# EAGLE design usb2ax_v3.2 (EAGLE 7.5.0)
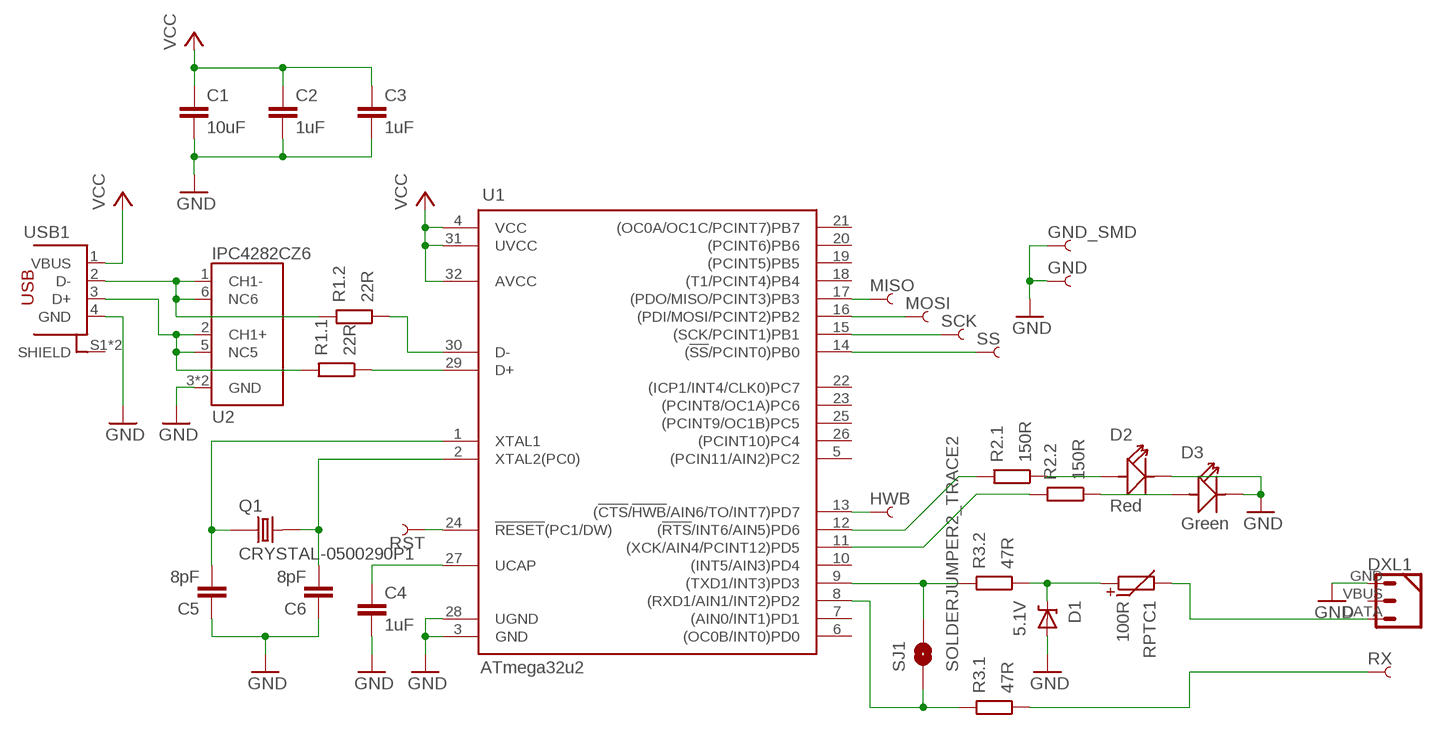
[diagram p0: schematic, sheet 1]

## Parts
C1  10uF  C0805_L  [0805_L]
C2  1uF  C0402  [0402_N]
C3  1uF  C0402  [0402_N]
C4  1uF  C0402  [0402_N]
C5  8pF  C0402  [0402_N]
C6  8pF  C0402  [0402_N]
D1  5.1V  DIODE_ZENER-923  [SOD-923_N]
D2  Red  LED  [LED0603]
D3  Green  LED  [LED0603]
DXL1  DYNAMIXEL_3POS  [DYMANIXEL_3POS_RIGHT]
GND  PIN_SMD_2X2.5  [PIN_SMD_2X2.5]
GND_SMD  PIN_SMD_2X2.5  [PIN_SMD_2X2.5]
HWB  PIN_SMD_2X2.5  [PIN_SMD_2X2.5]
MISO  PIN_SMD_2X2.5  [PIN_SMD_2X2.5]
MOSI  PIN_SMD_2X2.5  [PIN_SMD_2X2.5]
Q1  CRYSTAL-0500290P1  [2P-SMD-5.0X3.2]
R1  22R  R_2-0402  [ARRAY_0402_65P_2_N]
R2  150R  R_2-0402  [ARRAY_0402_65P_2_N]
R3  47R  R_2-0402  [ARRAY_0402_65P_2_N]
RPTC1  100R  R-PTC0603  [0603_N]
RST  PIN_SMD_2X2.5  [PIN_SMD_2X2.5]
RX  PIN_THT_0.8  [PIN_0.8]
SCK  PIN_SMD_2X2.5  [PIN_SMD_2X2.5]
SJ1  SOLDERJUMPER2_TRACE2  [SJ_2S-TRACE2]
SS  PIN_SMD_2X2.5  [PIN_SMD_2X2.5]
U1  ATmega32u2  IC_ATMEGAXXU2-MU_L_MOD  [QFN-32_50P_L_MOD]
U2  IPC4282CZ6  [XSON6_N]
USB1  USB-STANDARD-PLUG_A_THT  [USB-A-THT]

## Nets
GND: C1.2 C2.2 C3.2 C4.2 C5.1 C6.1 D1.A D2.- D3.- DXL1.GND GND.PIN GND_SMD.PIN U1.3(GND) U1.28(UGND) U2.3(GND) U2.4(GND) USB1.4(GND)
HWB: HWB.PIN U1.13((!CTS!/!HWB!/AIN6/TO/INT7)PD7)
N$1: R3.4 SJ1.2 U1.9((TXD1/INT3)PD3)
N$2: R3.3 SJ1.1 U1.8((RXD1/AIN1/INT2)PD2)
N$3: C4.1 U1.27(UCAP)
N$4: D1.C R3.1 RPTC1.1
N$5: R2.4 U1.11((XCK/AIN4/PCINT12)PD5)
N$6: DXL1.DATA RPTC1.2
N$7: C6.2 Q1.2 U1.2(XTAL2(PC0))
N$8: C5.2 Q1.1 U1.1(XTAL1)
N$9: R1.1 U1.30(D-)
N$10: R1.2 U1.29(D+)
N$11: R1.4 U2.1(CH1-) U2.6(NC6) USB1.2(D-)
N$12: R1.3 U2.2(CH1+) U2.5(NC5) USB1.3(D+)
N$13: D2.+ R2.2
N$14: D3.+ R2.1
N$15: R2.3 U1.12((!RTS!/INT6/AIN5)PD6)
N$16: R3.2 RX.PIN
N$17: MISO.PIN U1.17((PDO/MISO/PCINT3)PB3)
N$18: MOSI.PIN U1.16((PDI/MOSI/PCINT2)PB2)
N$19: SCK.PIN U1.15((SCK/PCINT1)PB1)
N$20: SS.PIN U1.14((!SS!/PCINT0)PB0)
RST: RST.PIN U1.24(!RESET!(PC1/DW))
VCC: C1.1 C2.1 C3.1 U1.4(VCC) U1.31(UVCC) U1.32(AVCC) USB1.1(VBUS)
Unconnected: DXL1.VBUS U1.5((PCIN11/AIN2)PC2) U1.6((OC0B/INT0)PD0) U1.7((AIN0/INT1)PD1) U1.10((INT5/AIN3)PD4) U1.18((T1/PCINT4)PB4) U1.19((PCINT5)PB5) U1.20((PCINT6)PB6) U1.21((OC0A/OC1C/PCINT7)PB7) U1.22((ICP1/INT4/CLK0)PC7) U1.23((PCINT8/OC1A)PC6) U1.25((PCINT9/OC1B)PC5) U1.26((PCINT10)PC4) USB1.S1(SHIELD) USB1.S2(SHIELD)

## Library data of the parts
C1-C6 = Xevelabs:C: Non-polarized Capacitor
D1 = Xevelabs:DIODE_ZENER: Zener Diode
D2 D3 = OPL:LED*: LED
DXL1 = Xevelabs:DYNAMIXEL_3POS
GND GND_SMD HWB MISO MOSI RST RX SCK SS = Xevelabs:PIN
Q1 = OPL:CRYSTAL*
R1-R3 = Xevelabs:R_2: Resistor Array of 2.
RPTC1 = Xevelabs:R-PTC: PTC (Positive Temperature Coefficient) Resistor
SJ1 = Xevelabs:SOLDERJUMPER2: Solder Jumper Standard SMD solder jumper. Used to automate production. Two varients : Normally Open and Normally Closed are the same, but have different paste layers. NC will have a large amount of paste and should jumper during reflow.
U1 = Xevelabs:IC_ATMEGAXXU2
U2 = Xevelabs:IPC4282CZ6: IPC4282CZ6 ESD suppressor from NXP
USB1 = Xevelabs:USB-STANDARD: USB (4 pins) connectors, plugs and receptacles.

## Board
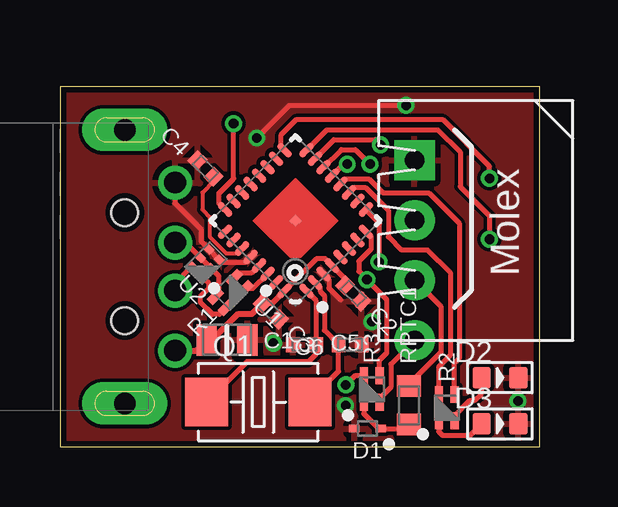
[diagram p1: board, top side]
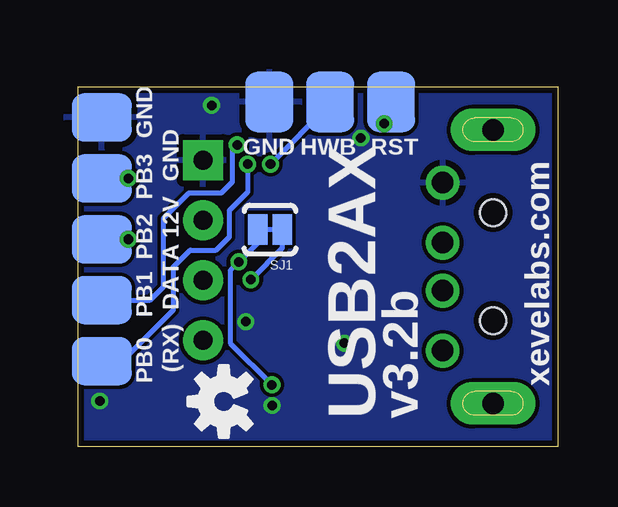
[diagram p2: board, bottom side, seen from below]

Size 20 x 15 mm. Coordinates in mm from the lower left corner, seen from the top.
Outline: 0,15 0,0 20,0 20,15 0,15
Copper layers (1*16): Top 0.035mm / dielectric 1.5mm / Bottom 0.035mm
Design rules "Fusion_eagle_rule_v1.1 *": minimum track width 6mil, minimum drill 12mil, track to track 6mil, track to pad 6mil, pad to pad 6mil, via to via 6mil, smd to smd 0mil, copper to edge 10mil, drill to drill 10mil, minimum pad ring 10mil, minimum via ring 6mil, stop-mask expansion 2mil, vias tented up to drill 100mil, thermal gap 10mil

### Footprints (pad centres in the part's own frame; a part is rotated, then mirrored left to right if it is on the bottom)
0805_L = smd 0.85 x 1.3: 1 -0.85,0; 2 0.85,0
0402_N = smd 0.57 x 0.62: 1 -0.48,0; 2 0.48,0
SOD-923_N = smd 0.43 x 0.32: A 0.55,0; C -0.55,0
LED0603 = smd 0.762 x 0.889: + -0.762,0; - 0.762,0
DYMANIXEL_3POS_RIGHT = drill 0.8 pad 1.676: DATA 0,-5; VBUS 0,-2.5 | drill 0.8 pad 1.676 square: GND 0,0
PIN_SMD_2X2.5 = smd 2.5 x 2: PIN 0,0
2P-SMD-5.0X3.2 = smd 1.778 x 2.032: 1 -2.159,0; 2 2.159,0
ARRAY_0402_65P_2_N = smd 0.7 x 0.35: 1 -0.55,0.325; 2 -0.55,-0.325; 3 0.55,-0.325; 4 0.55,0.325
0603_N = smd 0.9 x 1: 1 -0.8,0; 2 0.8,0
PIN_0.8 = drill 0.8 pad 1.676: PIN 0,0
SJ_2S-TRACE2 = smd 0.8 x 1.27: 1 -0.508,0; 2 0.508,0
QFN-32_50P_L_MOD = smd 0.75 x 0.3: 1 -2.4,1.75; 2 -2.4,1.25; 3 -2.4,0.75; 4 -2.4,0.25; 5 -2.4,-0.25; 6 -2.4,-0.75; 7 -2.4,-1.25; 8 -2.4,-1.75; 17 2.4,-1.75; 18 2.4,-1.25; 19 2.4,-0.75; 20 2.4,-0.25; 21 2.4,0.25; 22 2.4,0.75; 23 2.4,1.25; 24 2.4,1.75 | smd 0.3 x 0.75: 9 -1.75,-2.4; 10 -1.25,-2.4; 11 -0.75,-2.4; 12 -0.25,-2.4; 13 0.25,-2.4; 14 0.75,-2.4; 15 1.25,-2.4; 16 1.75,-2.4; 25 1.75,2.4; 26 1.25,2.4; 27 0.75,2.4; 28 0.25,2.4; 29 -0.25,2.4; 30 -0.75,2.4; 31 -1.25,2.4; 32 -1.75,2.4 | smd 0.35 x 0.35: 33 0,0
XSON6_N = smd 0.35 x 0.3: 1 -0.3,0.5; 2 -0.3,0; 3 -0.3,-0.5; 4 0.3,-0.5; 5 0.3,0; 6 0.3,0.5
USB-A-THT = drill 0.9: 1 2.1,-3.5; 2 2.1,-1; 3 2.1,1; 4 2.1,3.5 | drill 0.9 pad 1.778 long: S1 0,5.7; S2 0,-5.7 | hole 1.1: 0,-2.25; 0,2.25

### Placement (x,y rotation side)
C1  6.96,4.45 0 top
C2  12.23,6.39 315 top
C3  8.79,5.64 315 top
C4  6.07,11.59 135 top
C5  10.2,4.25 0 top
C6  12.1,4.25 180 top
D1  12.82,0.75 180 top
D2  18.35,2.88 0 top
D3  18.35,0.95 0 top
DXL1  14.79,11.93 0 top
GND  12.03,14.36 90 bottom
GND_SMD  19.01,13.72 0 bottom
HWB  9.49,14.36 90 bottom
MISO  19.01,11.18 0 bottom
MOSI  19.01,8.64 0 bottom
Q1  8.27,1.85 0 top
R1  7.1,6.42 225 top
R2  16.12,1.62 90 top
R3  13,2.4 90 top
RPTC1  14.55,1.73 90 top
RST  6.95,14.36 90 bottom
RX  14.79,4.43 0 top
SCK  19.01,6.1 0 bottom
SJ1  12,9.04 180 bottom
SS  19.01,3.56 0 bottom
U1  9.82,9.42 135 top
U2  6.08,7.65 135 top
U$1  [OSHW-LOGO-S]  13.93,1.88 90 bottom
USB1  2.7,7.5 0 top

### Tracks (layer width: path | path; a pad name or v marks a point on that pad's centre or on a via)
GND  (via drill 0.4)
  Top 0.2: U1.3 11.21,6.96 11.21,6.61 11.71,6.12 | U1.28 7.72,7.67 6.77,7.67 U2.3 U2.4 5.9,8.54 5.9,9.04 4.8,10.14 USB1.4 | v8.21,12.86 9.57,14.22 v14.43,14.22 | C2.2 12.4,5.88
  other vias: 8.9,4.31 13.01,5.21 19.1,1.9 11.91,1.72
  pour Bottom: -1.11,15.61 20.51,15.63 20.56,-0.93 -1.11,-0.93
  pour Top: -0.34,15.5 -0.34,-0.64 20.76,-0.64 20.97,15.77
HWB  (via drill 0.4)
  Top 0.2: U1.13 11.82,11.77 v11.98,11.77
  Bottom 0.2: v11.98,11.77 9.49,14.26 HWB.PIN
N$1  (via drill 0.4)
  Top 0.2: v13.3,7.7 13.33,7.73 13.33,9.3 U1.9 | R3.4 12.29,2.95 v11.92,2.58
  Bottom 0.2: SJ1.2 12.51,8.49 v13.3,7.7 13.63,7.37 13.63,4.29 v11.92,2.58
N$2  (via drill 0.4)
  Top 0.2: U1.8 12.97,8.74 12.97,8.23 12.46,7.72 12.46,7.3 v12.8,6.96 13.63,6.12 13.63,3.9 13.32,3.6 R3.3
  Bottom 0.2: SJ1.1 11.49,8.27 v12.8,6.96
N$3
  Top 0.16: C4.1 6.41,11.05 5.94,10.58 5.94,9.87 6.27,9.54 6.26,9.54 6.26,8.72 6.95,8.04 7.38,8.04 U1.27 | U1.27
N$4
  Top 0.2: R3.1 12.68,1.38 13.3,0.75 D1.C 14.38,0.75 RPTC1.1
N$5
  Top 0.2: U1.11 12.26,10.8 12.73,10.8 13.69,9.84 13.69,8.74 14.24,8.19 15.33,8.19 16.27,7.25 16.27,3.8 15.8,3.33 R2.4
N$6
  Top 0.2: DXL1.DATA 15.9,5.82 15.9,3.95 14.55,2.6 RPTC1.2
N$7
  Top 0.2: U1.2 10.85,6.63 10.85,6.47 11.03,6.29 11.03,4.84 C6.2 11.62,3.14 10.43,1.95 Q1.2
N$8
  Top 0.2: U1.1 10.68,6.09 C5.2 10.68,3.85 10.36,3.54 7.8,3.54 Q1.1
N$9
  Top 0.2: U1.30 8.04,6.58 R1.1
N$10
  Top 0.2: U1.29 7.98,7.23 7.45,7.23 R1.2
N$11
  Top 0.2: R1.4 6.65,5.51 6.36,5.51 5.85,6.02 5.85,6.24 6.19,6.58 6.19,6.83 U2.1 U2.6 4.8,6.79 USB1.2
N$12
  Top 0.2: R1.3 6.62,6.4 6.62,7.11 U2.2 U2.5 5.23,8.5 USB1.3
N$13
  Top 0.2: R2.2 16.45,1.27 17.1,1.93 17.3,1.93 17.59,2.21 D2.+
N$14
  Top 0.2: R2.1 15.8,0.62 15.95,0.47 17.11,0.47 D3.+
N$15
  Top 0.2: R2.3 16.45,3.48 16.65,3.67 16.65,9.3 15.38,10.57 13.47,10.57 12.88,11.16 11.91,11.16 U1.12
N$16
  Top 0.2: RX.PIN 13.79,3.44 13.79,2.47 13.32,2 R3.2
N$17  (via drill 0.4)
  Top 0.2: v17.91,11.18 17.91,11.68 15.98,13.61 9.84,13.61 9.2,12.97 9.2,12.52 U1.17
  Bottom 0.2: MISO.PIN v17.91,11.18
N$18  (via drill 0.4)
  Top 0.2: U1.16 11.12,13.2 15.77,13.2 16.69,12.28 16.69,10.83 17.91,9.61 v17.91,8.64
  Bottom 0.2: v17.91,8.64 MOSI.PIN
N$19  (via drill 0.4)
  Top 0.2: U1.15 11.42,12.79 13.15,12.79 v13.37,12.57
  Bottom 0.2: v13.37,12.57 13.58,12.36 13.58,11.02 14.04,10.56 15.39,10.56 16.44,9.51 16.44,6.66 17,6.1 SCK.PIN
N$20  (via drill 0.4)
  Top 0.2: v12.93,11.77 12.32,12.38 11.73,12.38 U1.14
  Bottom 0.2: v12.93,11.77 12.93,10.6 13.69,9.84 13.69,8.74 14.24,8.19 15.33,8.19 16.02,7.5 16.02,5.7 18.16,3.56 SS.PIN
RST  (via drill 0.4)
  Top 0.2: U1.24 6.63,10.13 6.63,10.56 7.24,11.17 v7.24,13.46
  Bottom 0.2: RST.PIN 7.24,14.07 v7.24,13.46
VCC
  Top 0.2: U1.32 10.71,7.83 11.06,7.83 U1.4 11.89,7 C2.1
  Top 0.25: USB1.1 5.67,4 C1.1 6.34,4.45 7.43,5.53 8,5.53 C3.1 | U1.31 8.45,6.28 C3.1 | U1.32 8.85,5.98 C3.1

### Text on the board
tPlace: Molex
bPlace: RST | HWB | GND | GND | GND | PB3 | 12V | PB2 | DATA | PB1 | xevelabs.com | (RX) | PB0 | v3.2b | USB2AX